# Altium schematic sheet Top_Level_Block_Diagram.SchDoc: BLDC Motor Driver Block Diagram
size A3; DocumentNumber: 1; SheetNumber: 1; SheetTotal: 51
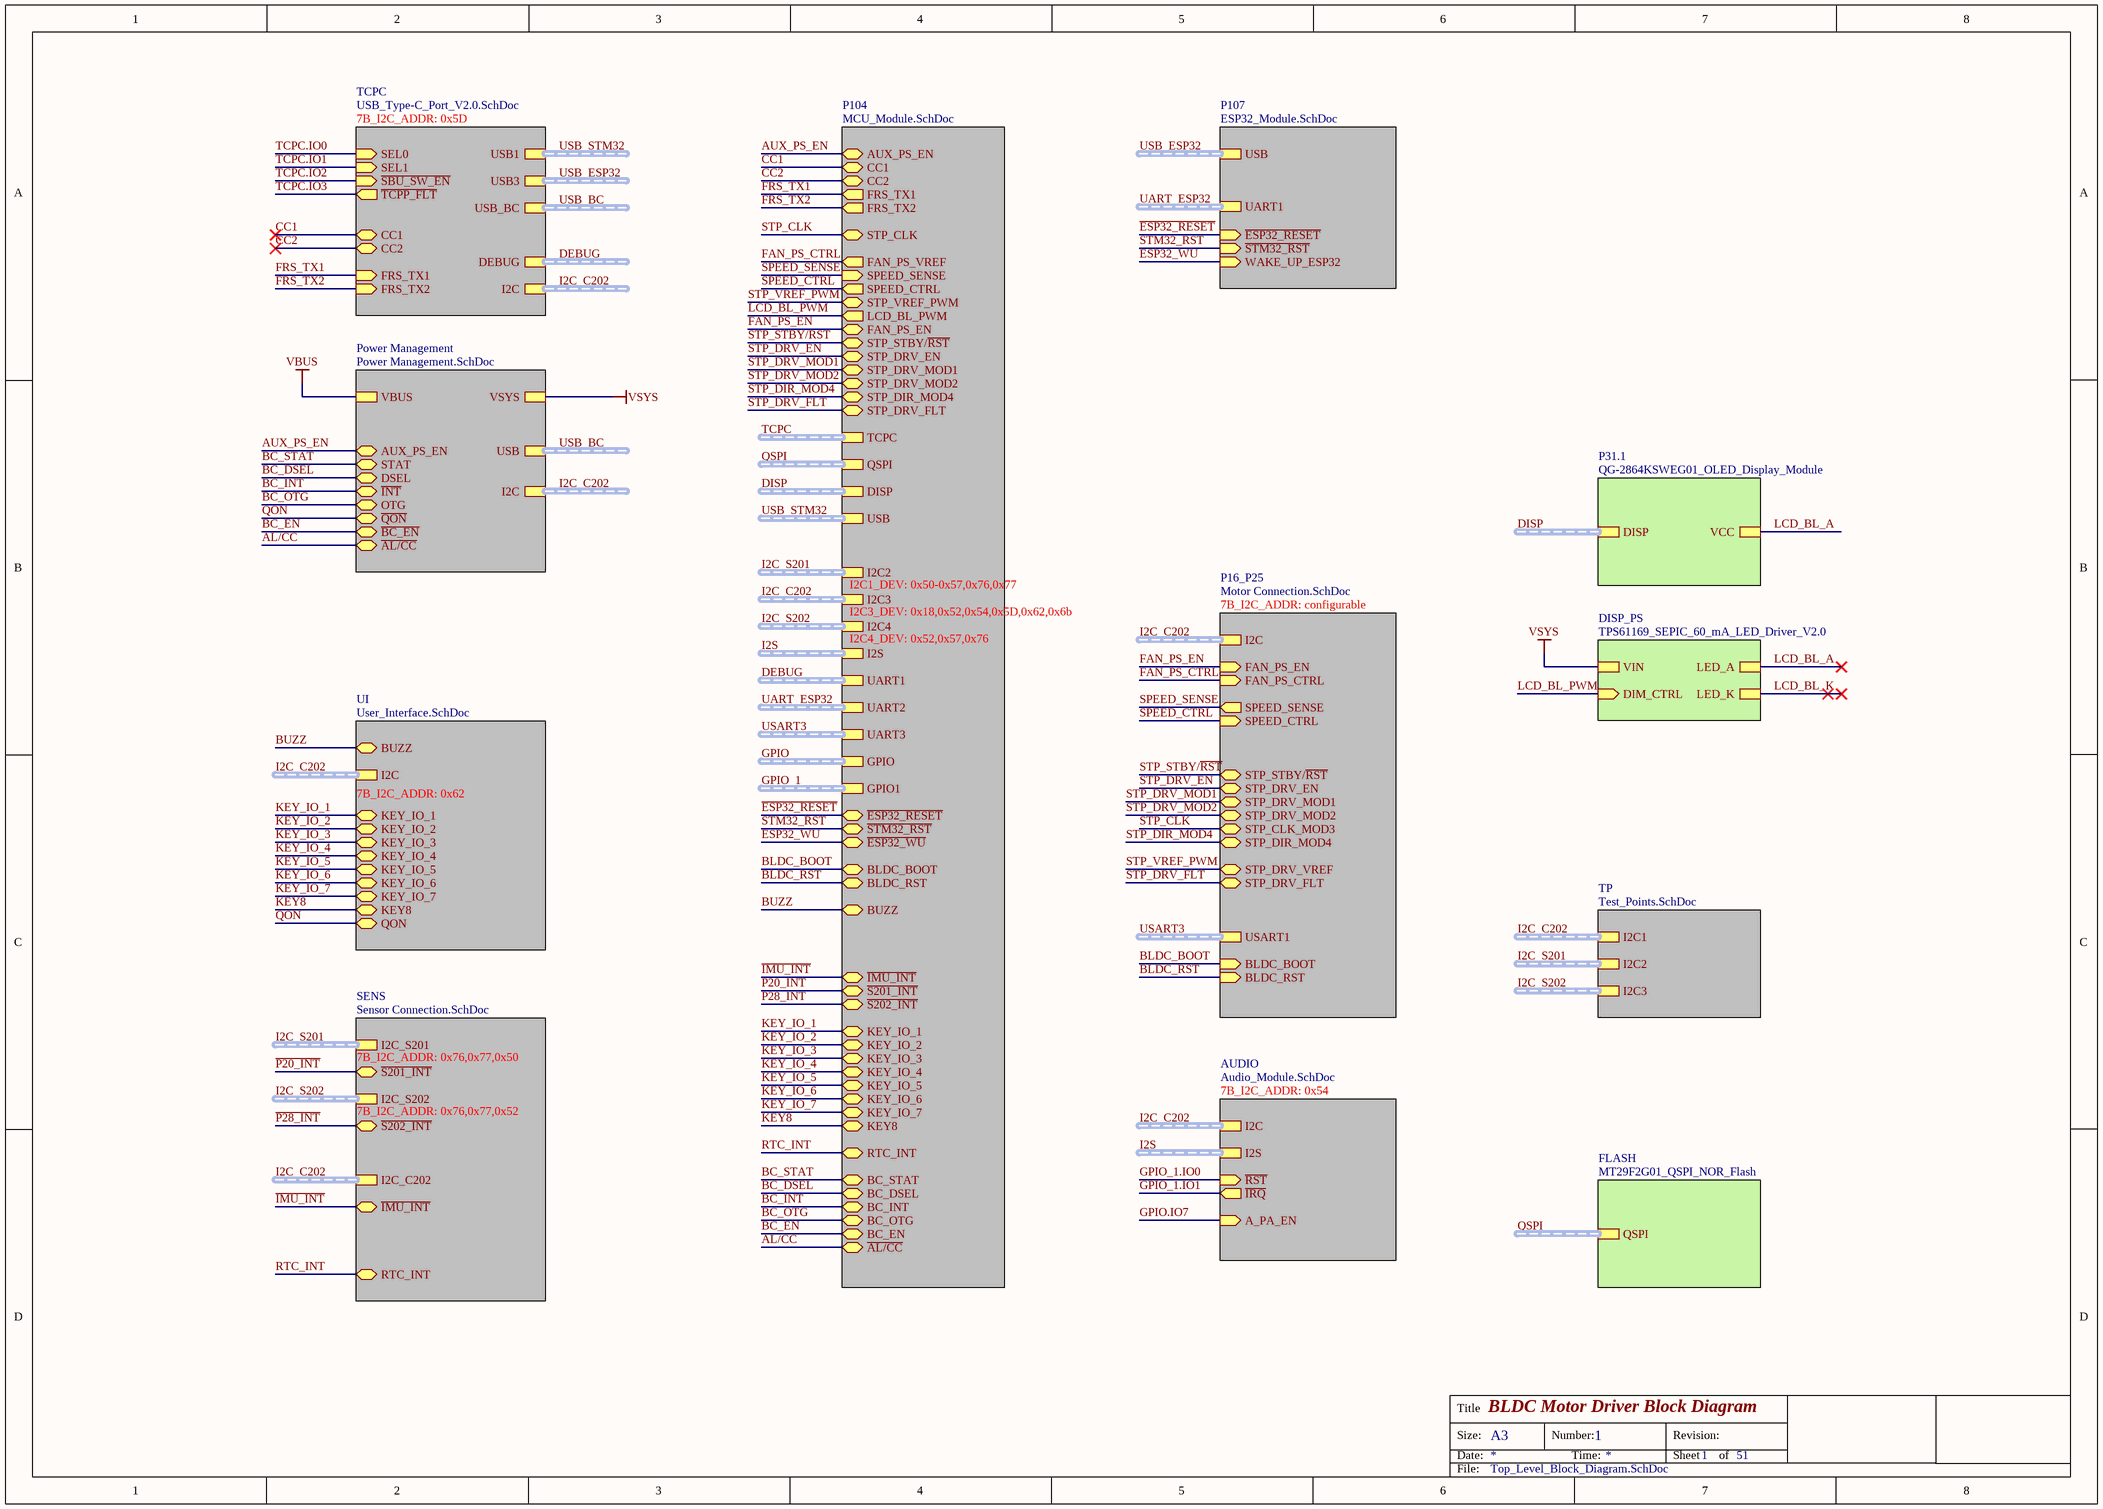
[diagram p0: Top_Level_Block_Diagram.SchDoc]

## Sub-sheets
AUDIO = Audio_Module.SchDoc: I2S (harness I2S), I2C (harness I2C), ~{RST} (in), ~{IRQ} (out), A_PA_EN (in)  | 7B_I2C_ADDR: 0x54
DISP_PS = TPS61169_SEPIC_60_mA_LED_Driver_V2.0: VIN, LED_K, DIM_CTRL (in), LED_A
FLASH = MT29F2G01_QSPI_NOR_Flash: QSPI (harness QSPI)
P16_P25 = Motor Connection.SchDoc: SPEED_CTRL (in), SPEED_SENSE (out), FAN_PS_CTRL (in), BLDC_RST (in), I2C (harness I2C), STP_STBY/~{RST} (bidir), STP_DRV_MOD1 (bidir), STP_DRV_MOD2 (bidir), STP_CLK_MOD3 (bidir), STP_DIR_MOD4 (bidir), STP_DRV_VREF (bidir), STP_DRV_FLT (bidir), FAN_PS_EN (in), USART1 (harness UART), BLDC_BOOT (in), STP_DRV_EN (bidir)  | 7B_I2C_ADDR: configurable
P31.1 = QG-2864KSWEG01_OLED_Display_Module: DISP (harness DISP_SPI), VCC
P104 = MCU_Module.SchDoc: FAN_PS_VREF (out), SPEED_CTRL (out), SPEED_SENSE (in), CC2 (bidir), CC1 (bidir), I2C2 (harness I2C), DISP (harness DISP_SPI), USB (harness USB), STP_CLK (bidir), STP_VREF_PWM (bidir), LCD_BL_PWM (out), QSPI (harness QSPI), FRS_TX1 (out), FRS_TX2 (out), I2C3 (harness I2C), UART1 (harness DEBUG), I2C4 (harness I2C), I2S (harness I2S), UART2 (harness UART), GPIO (harness GPIO), TCPC (harness GPIO), GPIO1 (harness GPIO), AUX_PS_EN (bidir), UART3 (harness UART), ~{ESP32_RESET} (bidir), ~{ESP32_WU} (bidir), BLDC_BOOT (bidir), BLDC_RST (bidir), BUZZ (bidir), ~{IMU_INT} (bidir), ~{S201_INT} (bidir), ~{S202_INT} (bidir), FAN_PS_EN (bidir), STP_STBY/~{RST} (bidir), STP_DRV_EN (bidir), STP_DRV_MOD1 (bidir), STP_DRV_MOD2 (bidir), STP_DIR_MOD4 (bidir), STP_DRV_FLT (bidir), KEY_IO_1 (bidir), KEY_IO_2 (bidir), KEY_IO_3 (bidir), KEY_IO_4 (bidir), KEY_IO_5 (bidir), KEY_IO_6 (bidir), KEY_IO_7 (bidir), KEY8 (bidir), RTC_INT (bidir), BC_STAT (bidir), BC_DSEL (bidir), BC_INT (bidir), BC_OTG (bidir), BC_EN (bidir), ~{STM32_RST} (bidir), ~{AL/CC} (bidir)  | I2C3_DEV: 0x18,0x52,0x54,0x5D,0x62,0x6b; I2C1_DEV: 0x50-0x57,0x76,0x77; I2C4_DEV: 0x52,0x57,0x76
P107 = ESP32_Module.SchDoc: ~{ESP32_RESET} (in), UART1 (harness UART), USB (harness USB), WAKE_UP_ESP32 (in), ~{STM32_RST} (in)
Power Management = Power Management.SchDoc: VBUS, AUX_PS_EN (bidir), STAT (bidir), DSEL (bidir), ~{INT} (bidir), OTG (bidir), ~{QON} (bidir), ~{BC_EN} (bidir), USB (harness USB), I2C (harness I2C), VSYS, ~{AL/CC} (bidir)
SENS = Sensor Connection.SchDoc: ~{S201_INT} (bidir), I2C_S201 (harness I2C), I2C_S202 (harness I2C), ~{S202_INT} (bidir), I2C_C202 (harness I2C), ~{IMU_INT} (bidir), RTC_INT (bidir)  | 7B_I2C_ADDR: 0x76,0x77,0x50; 7B_I2C_ADDR: 0x76,0x77,0x52
TCPC = USB_Type-C_Port_V2.0.SchDoc: CC1 (bidir), CC2 (bidir), USB1 (harness USB), SEL1 (in), SEL0 (in), ~{TCPP_FLT} (out), USB3 (harness USB), USB_BC (harness USB), FRS_TX1 (in), FRS_TX2 (in), I2C (harness I2C), ~{SBU_SW_EN} (in), DEBUG (harness DEBUG)  | 7B_I2C_ADDR: 0x5D
TP = Test_Points.SchDoc: I2C1 (harness I2C), I2C2 (harness I2C), I2C3 (harness I2C)
UI = User_Interface.SchDoc: KEY_IO_1 (bidir), BUZZ (bidir), I2C (harness I2C), KEY_IO_2 (bidir), KEY_IO_3 (bidir), KEY_IO_4 (bidir), KEY_IO_5 (bidir), KEY_IO_6 (bidir), KEY_IO_7 (bidir), KEY8 (bidir), QON (bidir)  | 7B_I2C_ADDR: 0x62

## Nets
VBUS: sheet Power Management/VBUS
VSYS: sheet Power Management/VSYS, sheet DISP_PS/VIN
~{ESP32_RESET}: sheet P104/~{ESP32_RESET}, sheet P107/~{ESP32_RESET}
~{ESP32_WU}: sheet P104/~{ESP32_WU}, sheet P107/WAKE_UP_ESP32
~{IMU_INT}: sheet P104/~{IMU_INT}, sheet SENS/~{IMU_INT}
~{P20_INT}: sheet P104/~{S201_INT}, sheet SENS/~{S201_INT}
~{P28_INT}: sheet P104/~{S202_INT}, sheet SENS/~{S202_INT}
~{STM32_RST}: sheet P104/~{STM32_RST}, sheet P107/~{STM32_RST}
AL/CC: sheet P104/~{AL/CC}, sheet Power Management/~{AL/CC}
AUX_PS_EN: sheet P104/AUX_PS_EN, sheet Power Management/AUX_PS_EN
BC_DSEL: sheet P104/BC_DSEL, sheet Power Management/DSEL
BC_EN: sheet P104/BC_EN, sheet Power Management/~{BC_EN}
BC_INT: sheet P104/BC_INT, sheet Power Management/~{INT}
BC_OTG: sheet P104/BC_OTG, sheet Power Management/OTG
BC_STAT: sheet P104/BC_STAT, sheet Power Management/STAT
BLDC_BOOT: sheet P104/BLDC_BOOT, sheet P16_P25/BLDC_BOOT
BLDC_RST: sheet P104/BLDC_RST, sheet P16_P25/BLDC_RST
BUZZ: sheet P104/BUZZ, sheet UI/BUZZ
CC1: sheet TCPC/CC1, sheet P104/CC1
CC2: sheet TCPC/CC2, sheet P104/CC2
FAN_PS_CTRL: sheet P104/FAN_PS_VREF, sheet P16_P25/FAN_PS_CTRL
FAN_PS_EN: sheet P104/FAN_PS_EN, sheet P16_P25/FAN_PS_EN
FRS_TX1: sheet TCPC/FRS_TX1, sheet P104/FRS_TX1
FRS_TX2: sheet TCPC/FRS_TX2, sheet P104/FRS_TX2
GPIO.IO7: sheet AUDIO/A_PA_EN
GPIO_1.IO0: sheet AUDIO/~{RST}
GPIO_1.IO1: sheet AUDIO/~{IRQ}
KEY8: sheet P104/KEY8, sheet UI/KEY8
KEY_IO_1: sheet P104/KEY_IO_1, sheet UI/KEY_IO_1
KEY_IO_2: sheet P104/KEY_IO_2, sheet UI/KEY_IO_2
KEY_IO_3: sheet P104/KEY_IO_3, sheet UI/KEY_IO_3
KEY_IO_4: sheet P104/KEY_IO_4, sheet UI/KEY_IO_4
KEY_IO_5: sheet P104/KEY_IO_5, sheet UI/KEY_IO_5
KEY_IO_6: sheet P104/KEY_IO_6, sheet UI/KEY_IO_6
KEY_IO_7: sheet P104/KEY_IO_7, sheet UI/KEY_IO_7
LCD_BL_A: sheet DISP_PS/LED_A, sheet P31.1/VCC
LCD_BL_K: sheet DISP_PS/LED_K
LCD_BL_PWM: sheet P104/LCD_BL_PWM, sheet DISP_PS/DIM_CTRL
QON: sheet Power Management/~{QON}, sheet UI/QON
RTC_INT: sheet P104/RTC_INT, sheet SENS/RTC_INT
SPEED_CTRL: sheet P104/SPEED_CTRL, sheet P16_P25/SPEED_CTRL
SPEED_SENSE: sheet P104/SPEED_SENSE, sheet P16_P25/SPEED_SENSE
STP_CLK: sheet P104/STP_CLK, sheet P16_P25/STP_CLK_MOD3
STP_DIR_MOD4: sheet P104/STP_DIR_MOD4, sheet P16_P25/STP_DIR_MOD4
STP_DRV_EN: sheet P104/STP_DRV_EN, sheet P16_P25/STP_DRV_EN
STP_DRV_FLT: sheet P104/STP_DRV_FLT, sheet P16_P25/STP_DRV_FLT
STP_DRV_MOD1: sheet P104/STP_DRV_MOD1, sheet P16_P25/STP_DRV_MOD1
STP_DRV_MOD2: sheet P104/STP_DRV_MOD2, sheet P16_P25/STP_DRV_MOD2
STP_STBY/~{RST}: sheet P104/STP_STBY/~{RST}, sheet P16_P25/STP_STBY/~{RST}
STP_VREF_PWM: sheet P104/STP_VREF_PWM, sheet P16_P25/STP_DRV_VREF
TCPC.IO0: sheet TCPC/SEL0
TCPC.IO1: sheet TCPC/SEL1
TCPC.IO2: sheet TCPC/~{SBU_SW_EN}
TCPC.IO3: sheet TCPC/~{TCPP_FLT}

## Buses and harness runs
harness DEBUG = sheet P104/UART1
harness DEBUG = sheet TCPC/DEBUG
harness DISP = sheet P31.1/DISP
harness DISP = sheet P104/DISP
harness GPIO = sheet P104/GPIO
harness GPIO_1 = sheet P104/GPIO1
harness I2C_C202 = sheet AUDIO/I2C
harness I2C_C202 = sheet P16_P25/I2C
harness I2C_C202 = sheet P104/I2C3
harness I2C_C202 = sheet Power Management/I2C
harness I2C_C202 = sheet SENS/I2C_C202
harness I2C_C202 = sheet TCPC/I2C
harness I2C_C202 = sheet TP/I2C1
harness I2C_C202 = sheet UI/I2C
harness I2C_S201 = sheet P104/I2C2
harness I2C_S201 = sheet SENS/I2C_S201
harness I2C_S201 = sheet TP/I2C2
harness I2C_S202 = sheet P104/I2C4
harness I2C_S202 = sheet SENS/I2C_S202
harness I2C_S202 = sheet TP/I2C3
harness I2S = sheet AUDIO/I2S
harness I2S = sheet P104/I2S
harness QSPI = sheet FLASH/QSPI
harness QSPI = sheet P104/QSPI
harness TCPC = sheet P104/TCPC
harness UART_ESP32 = sheet P104/UART2
harness UART_ESP32 = sheet P107/UART1
harness USART3 = sheet P16_P25/USART1
harness USART3 = sheet P104/UART3
harness USB_BC = sheet Power Management/USB
harness USB_BC = sheet TCPC/USB_BC
harness USB_ESP32 = sheet P107/USB
harness USB_ESP32 = sheet TCPC/USB3
harness USB_STM32 = sheet P104/USB
harness USB_STM32 = sheet TCPC/USB1

## Notes on the sheet
- Title
- Size:
- Date:
- A3
- Number:
- Time:
- Revision:
- Sheet
- of
- File: